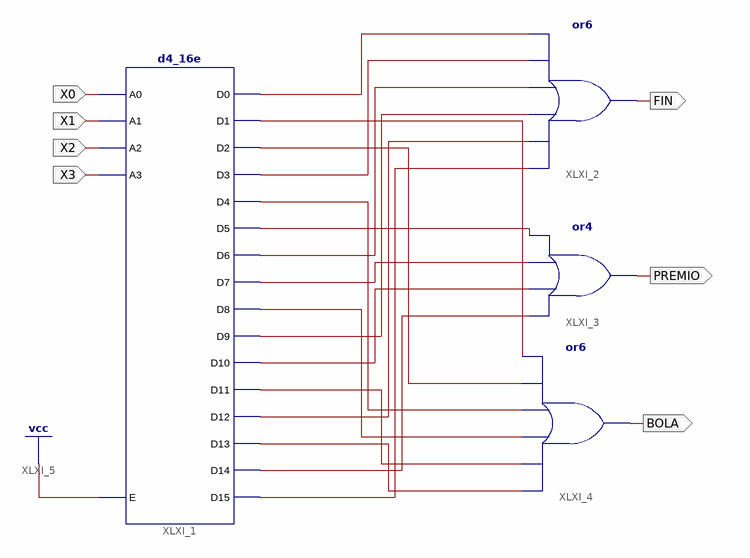
[diagram p0: schematic sheet 1]
// Xilinx ISE schematic p2ej1.sch (spartan3) as structural Verilog: 4 symbols, 7 ports
module p2ej1 (
  input  X0,
  input  X1,
  input  X2,
  input  X3,
  output FIN,
  output PREMIO,
  output BOLA
);

  wire XLXN_1, XLXN_2, XLXN_3, XLXN_4, XLXN_5, XLXN_6, XLXN_7, XLXN_8, XLXN_9, XLXN_10, XLXN_11, XLXN_12,
       XLXN_13, XLXN_14, XLXN_15, XLXN_16;

  d4_16e XLXI_1 (
    .A0(X0), .A1(X1), .A2(X2), .A3(X3), .E(1'b1), .D0(XLXN_6), .D1(XLXN_11), .D10(XLXN_8), .D11(XLXN_15),
    .D12(XLXN_2), .D13(XLXN_16), .D14(XLXN_7), .D15(XLXN_1), .D2(XLXN_12), .D3(XLXN_5), .D4(XLXN_13),
    .D5(XLXN_10), .D6(XLXN_4), .D7(XLXN_9), .D8(XLXN_14), .D9(XLXN_3));
  or XLXI_2 (FIN, XLXN_1, XLXN_2, XLXN_3, XLXN_4, XLXN_5, XLXN_6);
  or XLXI_3 (PREMIO, XLXN_7, XLXN_8, XLXN_9, XLXN_10);
  or XLXI_4 (BOLA, XLXN_16, XLXN_15, XLXN_14, XLXN_13, XLXN_12, XLXN_11);
endmodule
